# EAGLE board Cannula_mother (EAGLE 8.6.0)
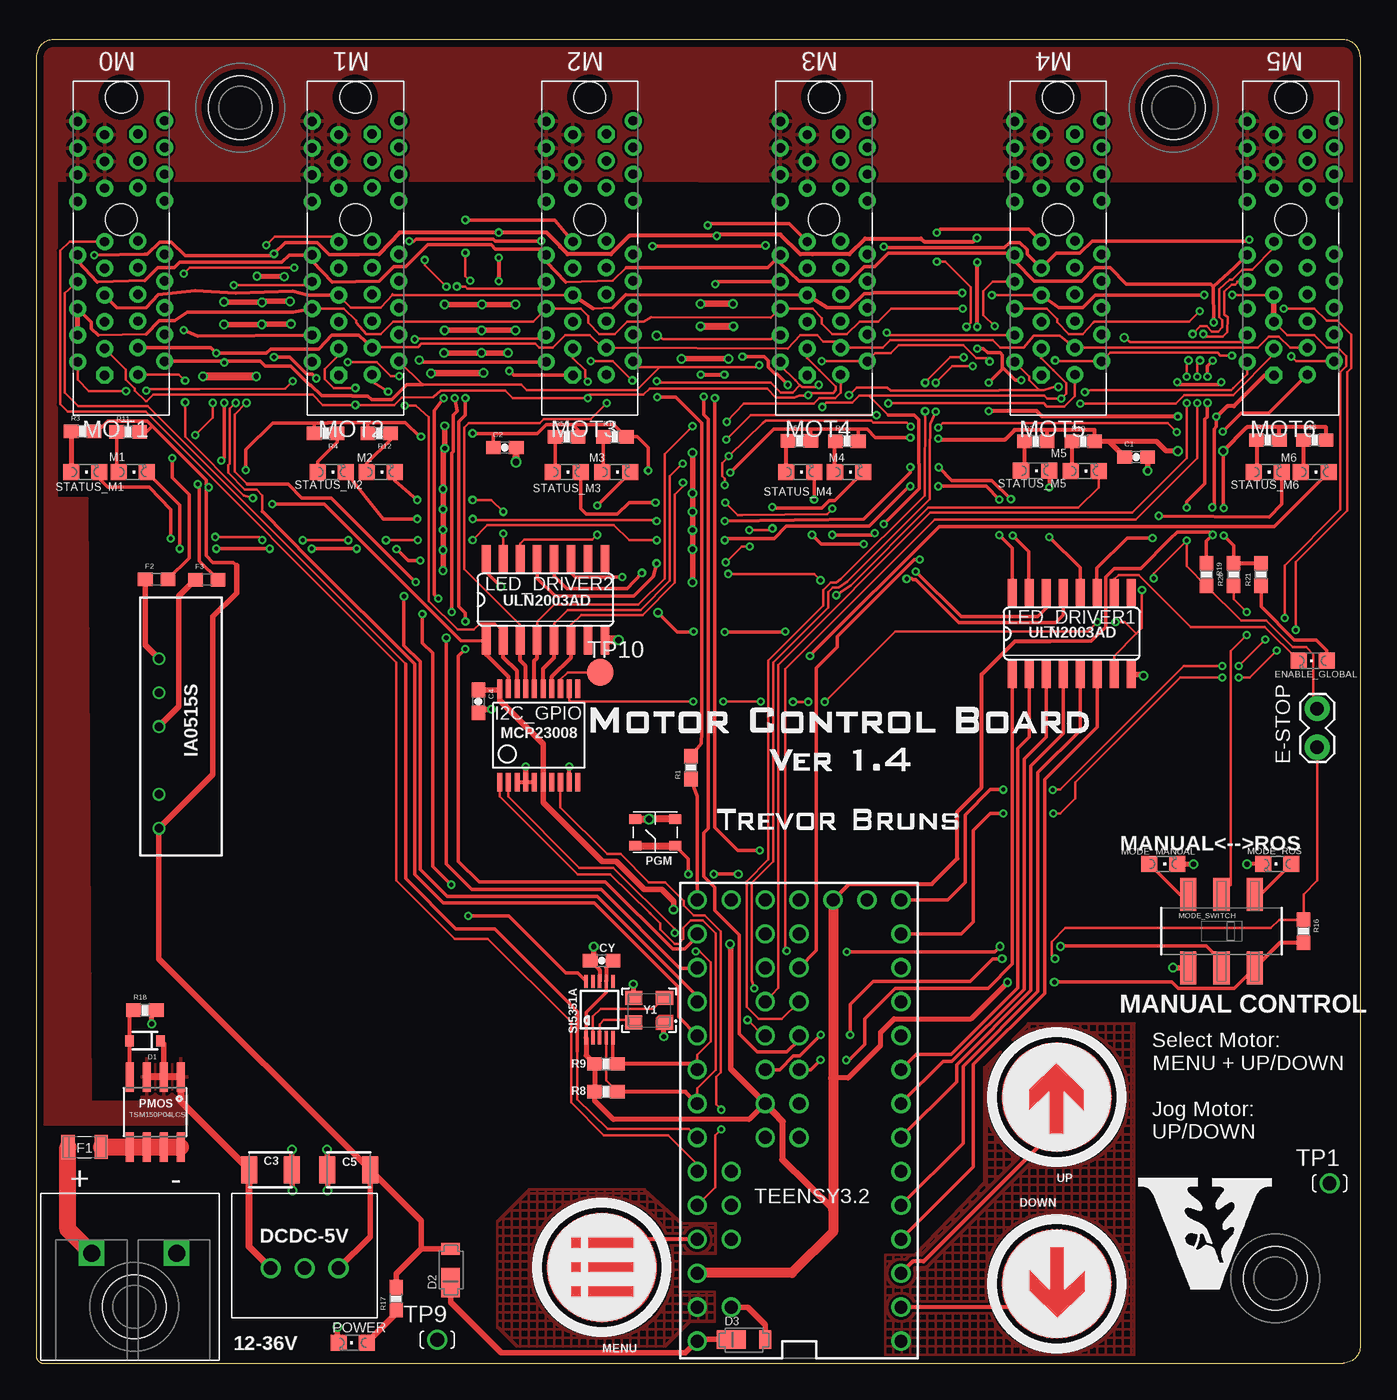
[diagram p1: board, top side]
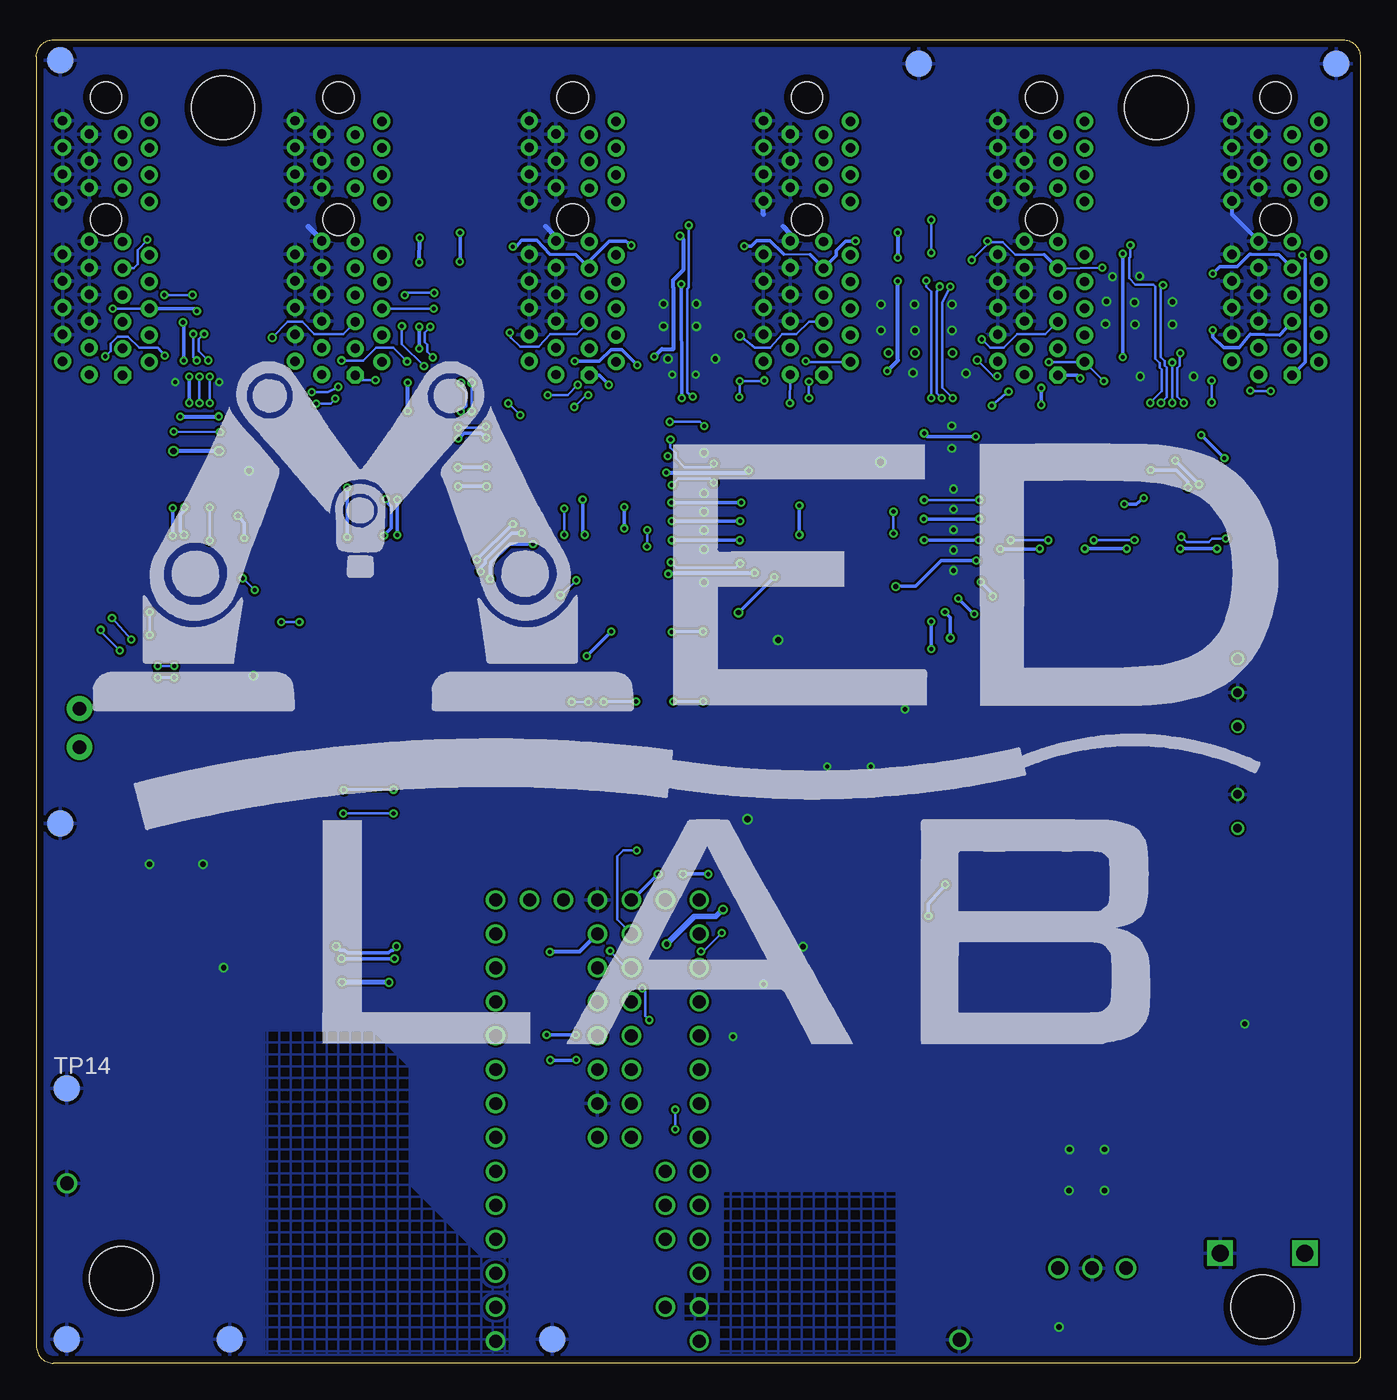
[diagram p2: board, bottom side, seen from below]

Size 99.06 x 99.06 mm. Coordinates in mm from the lower left corner, seen from the top.
Outline: 99.06,97.79 99.06,1.27 arc-90 97.79,0 0.51,0 arc-90 0,0.51 0,97.79 arc-90 1.27,99.06 97.79,99.06 arc-90 99.06,97.79
Copper layers (1*16): Top 0.035mm / dielectric 1.5mm / Bottom 0.035mm
Design rules "PCBWay_2018-01-18": minimum track width 6mil, minimum drill 12mil, track to track 6.5mil, track to pad 6.5mil, pad to pad 6.5mil, via to via 6.5mil, smd to smd 6mil, copper to edge 20mil, drill to drill 8mil, minimum pad ring 6mil, minimum via ring 6mil, stop-mask expansion 4mil, vias tented up to drill 0mil, thermal gap 10mil
Net classes: 1 differential: width 0.152 mm, clearance 0.203 mm

## Footprints (pad centres in the part's own frame; a part is rotated, then mirrored left to right if it is on the bottom)
SPACER = hole 4.75: 0,0
0603-CAP = smd 1.1 x 1: 1 -0.85,0; 2 0.85,0
1210 = smd 1.2 x 2: 1 -1.6,0; 2 1.6,0
MSOP10 = smd 0.25 x 1: 1 -1,-2.113; 2 -0.5,-2.113; 3 0,-2.113; 4 0.5,-2.113; 5 1,-2.113; 6 1,2.113; 7 0.5,2.113; 8 0,2.113; 9 -0.5,2.113; 10 -1,2.113
SOD-323 = smd 0.63 x 0.83: A 1.15,0; C -1.15,0
POWERDI123 = smd 2.2 x 1.4: P$1 -1.6,0 | smd 0.9 x 1.4: P$2 0.95,0
OKI-78SR = drill 1: P$1 -2.54,0; P$2 0,0; P$3 2.54,0
BUTTON_PASSIVE_8MM_UP = smd 0.508 x 0.508: BUTTON 0,3.175
1X02_LOCK = drill 1.016 pad 1.88: 1 -0.178,0; 2 2.718,0
LED-0805 = smd 1.2 x 1.2: A 0,-1.05; C 0,1.05
1206 = smd 1 x 1.8: P$1 -1.25,0; P$2 1.25,0
0603 = smd 1.1 x 1: 1 -0.85,0; 2 0.85,0
SSOP20 = smd 0.38 x 1.4: 1 -2.925,-3.5; 2 -2.275,-3.5; 3 -1.625,-3.5; 4 -0.975,-3.5; 5 -0.325,-3.5; 6 0.325,-3.5; 7 0.975,-3.5; 8 1.625,-3.5; 9 2.275,-3.5; 10 2.925,-3.5; 11 2.925,3.5; 12 2.275,3.5; 13 1.625,3.5; 14 0.975,3.5; 15 0.325,3.5; 16 -0.325,3.5; 17 -0.975,3.5; 18 -1.625,3.5; 19 -2.275,3.5; 20 -2.925,3.5
DCDC_IA_SERIES = drill 0.635: 0V 3.302,-1.397; +VIN -6.858,-1.397; +VOUT 5.842,-1.397; -VIN -4.318,-1.397; -VOUT 0.762,-1.397
SO16 = smd 0.66 x 2.032: 1 -4.445,-3.073; 2 -3.175,-3.073; 3 -1.905,-3.073; 4 -0.635,-3.073; 5 0.635,-3.073; 6 1.905,-3.073; 7 3.175,-3.073; 8 4.445,-3.073; 9 4.445,3.073; 10 3.175,3.073; 11 1.905,3.073; 12 0.635,3.073; 13 -0.635,3.073; 14 -1.905,3.073; 15 -3.175,3.073; 16 -4.445,3.073
BUTTON_PASSIVE_8MM_MENU = smd 0.508 x 0.508: BUTTON 0,3.175
JS202011SCQN = smd 1.2 x 2.5: 1 -2.5,-2.75; 2 0,-2.75; 3 2.5,-2.75; 4 -2.5,2.75; 5 0,2.75; 6 2.5,2.75
PCIE-36-SKT = drill 0.7 pad 1.27 octagon: A1 -11.65,1.25; B17 6.4,-1.25 | drill 0.7 pad 1.27: A2 -10.65,3.25; A3 -9.65,1.25; A4 -8.65,3.25; A5 -7.65,1.25; A6 -6.65,3.25; A7 -5.65,1.25; A8 -4.65,3.25; A9 -3.65,1.25; A10 -2.65,3.25; A11 -1.65,1.25; A12 1.35,3.25; A13 2.35,1.25; A14 3.35,3.25; A15 4.35,1.25; A16 5.35,3.25; A17 6.35,1.25; A18 7.35,3.25; B1 -11.6,-1.25; B2 -10.6,-3.25; B3 -9.6,-1.25; B4 -8.6,-3.25; B5 -7.6,-1.25; B6 -6.6,-3.25; B7 -5.6,-1.25; B8 -4.6,-3.25; B9 -3.6,-1.25; B10 -2.6,-3.25; B11 -1.6,-1.25; B12 1.4,-3.25; B13 2.4,-1.25; B14 3.4,-3.25; B15 4.4,-1.25; B16 5.4,-3.25; B18 7.4,-3.25 | hole 2.35: 0,0; 9.15,0
LS38 = smd 0.9 x 0.7: P$1 -1.5,-1; P$2 1.5,-1; P$3 -1.5,1; P$4 1.5,1
1X02_6.35_SCREWTERM = drill 1.27 square: P1 6.35,0; P2 0,0
0603-RES = smd 1.1 x 1: 1 -0.85,0; 2 0.85,0
TEENSY_3.0_ALLPINS = drill 0.965: 0 -7.62,13.97; 1 -7.62,11.43; 2 -7.62,8.89; 3 -7.62,6.35; 3.3V 7.62,11.43; 3.3V1 -2.54,-16.51; 3.3V2 2.54,-1.27; 4 -7.62,3.81; 5 -7.62,1.27; 6 -7.62,-1.27; 7 -7.62,-3.81; 8 -7.62,-6.35; 9 -7.62,-8.89; 10 -7.62,-11.43; 11 -7.62,-13.97; 12 -7.62,-16.51; 13 7.62,-16.51; 14/A0 7.62,-13.97; 15/A1 7.62,-11.43; 16/A2 7.62,-8.89; 17/A3 7.62,-6.35; 18/A4 7.62,-3.81; 19/A5 7.62,-1.27; 20/A6 7.62,1.27; 21/A7 7.62,3.81; 22/A8 7.62,6.35; 23/A9 7.62,8.89; 24 0,-3.81; 25 0,-6.35; 26 0,-8.89; 27 0,-11.43; 28 0,-13.97; 29 2.54,-13.97; 30 2.54,-11.43; 31 2.54,-8.89; 32 2.54,-6.35; 33 2.54,-3.81; A10 5.08,6.35; A11 5.08,3.81; A12 0,1.27; A13 2.54,1.27; AGND 7.62,13.97; AREF 5.08,8.89; GND -7.62,16.51; GND1 0,-16.51; GND2 0,-1.27; PGM 2.54,-16.51; RESET 5.08,-16.51; VBAT -5.08,-16.51; VIN 7.62,16.51; VUSB 5.08,13.97
TEST-POINT_5021 = drill 1.016: P$1 0,0
TP20R = smd 2 x 2: TP 0,0
SO08 = smd 0.61 x 2.21: 1 -1.905,-2.616; 2 -0.635,-2.616; 3 0.635,-2.616; 4 1.905,-2.616; 5 1.905,2.616; 6 0.635,2.616; 7 -0.635,2.616; 8 -1.905,2.616
CX3225SB = smd 1.3 x 1.05: GND@1 -1.15,0.925; HOT1 -1.15,-0.925; HOT2 1.15,0.925 | smd 1.1 x 0.85: GND@2 1.2,-0.975

## Placement (x,y rotation side)
24V  [SPACER]  7.32,4.22 180 top
C1  100nF  [0603-CAP]  82.3,67.82 0 top
C2  100nF  [0603-CAP]  35.05,68.53 0 top
C3  10uF  [1210]  17.53,14.48 0 top
C4  100nF  [0603-CAP]  33.07,49.53 270 top
C5  10uF  [1210]  23.37,14.48 180 top
CLOCKGEN  SI5351A  [MSOP10]  42.14,26.47 0 top
CY  100nF  [0603-CAP]  42.29,30.12 180 top
D1  10V  [SOD-323]  8.13,24.13 180 top
D2  DIODE-POWERDI123  [POWERDI123]  30.99,7.62 90 top
D3  DIODE-POWERDI123  [POWERDI123]  53.59,1.78 0 top
DCDC-5V  OKI-78SR  [OKI-78SR]  20.07,7.11 0 top
DOWN  [BUTTON_PASSIVE_8MM_UP]  76.35,5.94 180 top
E-STOP  M02LOCK  [1X02_LOCK]  95.83,46.28 90 top
ENABLE_GLOBAL  LED_R  [LED-0805]  95.5,52.58 90 top
F1  12A  [1206]  3.61,16.18 0 top
F2  PTC0603  [0603]  8.99,58.67 0 top
F3  PTC0603  [0603]  12.75,58.65 0 top
I2C_GPIO  MCP23008  [SSOP20]  37.59,46.99 0 top
IA0515S  DCDC_IA_SERIES0515S  [DCDC_IA_SERIES]  7.77,46.89 90 top
LED_DRIVER1  ULN2003AD  [SO16]  77.47,54.61 0 top
LED_DRIVER2  ULN2003AD  [SO16]  38.1,57.15 0 top
M1  LED_R  [LED-0805]  7.21,66.7 270 top
M2  LED_R  [LED-0805]  25.76,66.7 270 top
M3  LED_R  [LED-0805]  43.38,66.7 270 top
M4  LED_R  [LED-0805]  60.81,66.7 270 top
M5  LED_R  [LED-0805]  78.44,66.78 270 top
M6  LED_R  [LED-0805]  95.66,66.7 270 top
MENU  [BUTTON_PASSIVE_8MM_MENU]  42.32,7.16 0 top
MODE_MANUAL  LED_G  [LED-0805]  84.33,37.36 270 top
MODE_ROS  LED_G  [LED-0805]  92.86,37.36 90 top
MODE_SWITCH  SWITCH-DPDT-SLIDER-SMD  [JS202011SCQN]  88.68,32.33 0 top
MOT1  [PCIE-36-SKT]  6.35,85.6 90 top
MOT2  [PCIE-36-SKT]  23.88,85.6 90 top
MOT3  [PCIE-36-SKT]  41.4,85.6 90 top
MOT4  [PCIE-36-SKT]  58.93,85.6 90 top
MOT5  [PCIE-36-SKT]  76.45,85.6 90 top
MOT6  [PCIE-36-SKT]  93.85,85.6 90 top
PGM  SWITCH-TACT  [LS38]  46.3,39.73 0 top
POWER  LED_G  [LED-0805]  23.67,1.52 90 top
PWN_MAIN  M026.35MM_SCREWTERM  [1X02_6.35_SCREWTERM]  4.14,8.23 0 top
R1  33  [0603-RES]  48.97,44.58 90 top
R2  140  [0603-RES]  74.78,68.99 0 top
R3  140  [0603-RES]  3.45,69.75 0 top
R4  140  [0603-RES]  21.64,69.6 180 top
R5  140  [0603-RES]  39.67,69.34 0 top
R6  140  [0603-RES]  57.1,69.04 0 top
R7  140  [0603-RES]  92.15,69.09 0 top
R8  2.7k  [0603-RES]  42.62,20.32 180 top
R9  2.7k  [0603-RES]  42.62,22.4 180 top
R10  150  [0603-RES]  78.33,68.99 0 top
R11  150  [0603-RES]  6.86,69.7 0 top
R12  150  [0603-RES]  25.65,69.6 180 top
R13  150  [0603-RES]  43.28,69.34 0 top
R14  150  [0603-RES]  60.66,69.01 0 top
R15  150  [0603-RES]  95.66,69.09 0 top
R16  10k  [0603-RES]  94.82,32.33 270 top
R17  140  [0603-RES]  26.92,4.83 90 top
R18  10k  [0603-RES]  8.13,26.42 0 top
R19  10k  [0603-RES]  87.55,59.03 270 top
R20  140  [0603-RES]  89.59,59.03 90 top
R21  150  [0603-RES]  91.64,59.03 90 top
STATUS_M1  LED_G  [LED-0805]  3.66,66.7 270 top
STATUS_M2  LED_G  [LED-0805]  22.1,66.7 270 top
STATUS_M3  LED_G  [LED-0805]  39.67,66.7 270 top
STATUS_M4  LED_G  [LED-0805]  57.15,66.7 270 top
STATUS_M5  LED_G  [LED-0805]  74.73,66.8 270 top
STATUS_M6  LED_G  [LED-0805]  92.15,66.7 270 top
TEENSY3.2  TEENSY_3.0_ALLPINS  [TEENSY_3.0_ALLPINS]  57.07,18.16 180 top
TP1  TEST-POINT_5021  [TEST-POINT_5021]  96.77,13.46 0 top
TP2  PTR1TP20R  [TP20R]  1.78,97.28 0 bottom
TP3  PTR1TP20R  [TP20R]  96.77,1.78 0 bottom
TP4  PTR1TP20R  [TP20R]  97.28,97.54 0 bottom
TP5  PTR1TP20R  [TP20R]  33.02,97.28 0 bottom
TP6  PTR1TP20R  [TP20R]  84.58,1.78 0 bottom
TP7  PTR1TP20R  [TP20R]  60.45,1.78 0 bottom
TP8  PTR1TP20R  [TP20R]  97.28,40.39 0 bottom
TP9  TEST-POINT_5021  [TEST-POINT_5021]  30,1.75 0 top
TP10  PTR1TP20R  [TP20R]  42.19,51.71 0 top
TP14  PTR1TP20R  [TP20R]  96.77,20.57 0 bottom
TSM150P04LCS  PMOS  [SO08]  8.89,18.8 180 top
U$1  [SPACER]  92.71,6.35 180 top
U$2  [LOGO_MOTOR_CONTROL_1.4]  60.22,44.45 0 top
U$3  [SPACER]  85.09,93.98 180 top
U$4  [SPACER]  15.27,93.98 180 top
U$6  [LOGO_MEDLAB_3X2]  50.77,49.48 0 bottom
U$8  [LOGO_V_OAK]  87.88,10.41 0 top
UP  [BUTTON_PASSIVE_8MM_UP]  76.35,19.91 0 top
Y1  25 MHZ  [CX3225SB]  45.85,26.42 0 top

## Tracks (layer width: path | path; a pad name or v marks a point on that pad's centre or on a via)
3.3V  (via drill 0.3, 0.3 pad 0.41, 0.36, 0.41)
  Top 0.254: 25.65,83.01 24.13,82.98 23.62,82.98 22.15,82.96 21.93,82.96 21.01,83.88 18.62,83.88 v17.78,83.03 17.63,82.88 11.12,82.88 10.08,83.92 9.22,83.92 8.3,83.01 8.1,83.01 v4.34,82.93 | CLOCKGEN.7 42.64,27.75 41.15,26.26 41.15,24.36 CLOCKGEN.1 | v70.41,75.95 70.86,75.95 71.18,75.63 72.11,75.63 72.28,75.46 72.28,74.56 | v73.69,73.58 73.26,73.58 72.28,74.56 | v71.27,73.41 72.28,74.41 72.28,74.56 | v52.83,75.34 54.46,75.34 54.75,75.04 54.75,74.56 55.29,74.02 55.44,74.02 v56.24,73.23 | v35.38,74.27 35.7,73.95 MOT3.A1 | v20.95,73.71 20.64,74.02 20.24,74.02 18.95,75.31 v17.78,75.31 | v76.17,28.52 84.97,28.52 85.46,28.04 89.64,28.04 MODE_SWITCH.3 | v88.29,70.84 88.29,70.09 88.12,69.92 88.12,64.2 v87.99,64.06 | R19.1 87.55,61.54 v88.01,62 87.8,62.22 85.36,62.22 84.81,61.67 82.62,59.49 80.67,59.49 80.01,58.83 80.01,55.12 78.94,54.05 75.84,54.05
  Top 0.305: 25.65,83.01 27.18,84.63 v34.59,84.63 38.18,84.63 39.2,83.61 39.2,83.55 39.76,83 43,83 44.38,84.38 v50.9,84.38 51,84.48 55.68,84.48 57.16,83 58.07,83 58.08,83.01 60.84,83.01 62.02,84.19 66.18,84.19 66.42,83.95 70.1,83.95 v70.38,84.23 | MOT6.A1 91.93,73.95 89.61,71.63 89.11,71.63 88.33,70.84 v88.29,70.84 | CY.1 42.64,29.62 CLOCKGEN.7 | v85.42,70.87 75.25,70.87 74.84,71.27 v71.27,71.27 | v70.41,77.57 v70.41,82.4 | v34.59,82.75 v34.59,81 | TEENSY3.2.3.3V1 60.81,35.87 67,35.87 68.91,37.77 68.91,41.27 70.74,43.1 70.74,51.56 73.23,54.05 75.84,54.05 | MODE_SWITCH.3 93.08,31.48 R16.2
  Top 0.356: 59.61,21.34 60.73,21.34 63.14,23.75 63.14,24.74 64.19,25.78 69.95,25.78 v72.67,28.5
  Top 0.381: CLOCKGEN.1 41.14,23.04 R9.2 R8.2 41.77,19.65 43.18,18.24 53.34,18.24 TEENSY3.2.3.3V2
  Top 0.406: v51.89,31.37 51.94,31.32 51.94,22.02 TEENSY3.2.3.3V2 | v47.68,33.96 47.68,34.57 46.79,35.46 45.49,35.46 43.38,37.57 42.33,37.57 37.92,41.98 I2C_GPIO.6 37.92,46.34 34.67,49.59 I2C_GPIO.20 34.56,50.38 C4.1
  Top 0.457: 55.83,18.09 55.83,15.24
  Top 0.508: TEENSY3.2.3.3V2 55.83,18.09 | 55.83,15.24 59.61,11.51
  Top 0.762: TEENSY3.2.3.3V1 59.61,21.34 59.61,11.51 59.61,9.83 56.54,6.76 49.48,6.76 TEENSY3.2.3.3V
  Bottom 0.203: MOT5.A1 74.84,73.58 v73.69,73.58
  Bottom 0.254: MOT1.A1 4.12,74.93 4.12,82.65 v4.34,82.93 | MOT4.A1 56.95,73.95 v56.24,73.23 | v70.41,75.95 v70.41,77.57 | MOT2.A1 21.19,73.95 v20.95,73.71 | v17.78,75.31 v17.78,83.03 | v87.99,64.06 87.99,63.83 88.29,63.52 88.29,62.28 v88.01,62
  Bottom 0.305: v88.29,70.84 85.45,70.84 v85.42,70.87 | v71.27,71.27 v71.27,73.41 | v70.41,82.4 v70.38,84.23 | v52.83,75.34 52.25,75.92 51.38,75.92 51.38,80.48 51.42,80.51 51.42,81.06 50.66,81.83 50.66,84.14 v50.9,84.38 | v34.59,84.63 v34.59,82.75 | v35.38,74.27 34.59,75.06 v34.59,81
  Bottom 0.356: v72.67,28.5 76.15,28.5 v76.17,28.52
  Bottom 0.406: v51.89,31.37 49.84,33.43 48.21,33.43 v47.68,33.96
5V  (via drill 0.3, 0.46)
  Top 0.203: 57.94,69.9 57.95,69.89
  Top 0.254: 40.13,70.26 43.22,70.26 R13.2 44.96,69.34 45.77,68.53 v45.77,66.8 | 40.13,70.26 38.15,70.26 37.49,69.6 34.29,69.6 | v51.92,66.65 55.17,69.9 57.94,69.9 | R5.2 40.52,69.86 40.13,70.26 | 24.89,70.4 27.62,70.4 28.68,69.34 v28.78,69.34 | 24.89,70.4 21.82,70.4 21.8,70.38 20.83,70.38 | 20.83,70.38 17.68,70.38 15.67,68.38 v15.67,66.85 | R4.2 20.79,70.35 20.83,70.38 | R12.2 24.8,70.31 24.89,70.4 | R3.2 4.58,69.75 5.33,70.5 8.31,70.5 8.67,70.14 | 8.67,70.14 11.21,67.6 | 11.21,67.6 11.47,67.34 | R11.2 8.23,69.7 8.67,70.14 | 11.21,67.6 12.7,66.11 12.7,65.75 v12.89,65.56 12.7,65.37 12.7,60.45 13.21,59.94 14.73,59.94 14.99,59.69 | R6.2 57.94,69.05 57.94,69.9 | 57.94,69.9 61.47,69.9 | R14.2 61.51,69.86 61.47,69.9 | v65.41,69.29 62.79,69.29 62.18,69.9 61.47,69.9 | 34.29,69.6 v32.64,69.6 | C2.1 34.2,69.51 34.29,69.6 | v88.8,68.28 88.8,64.06 v88.85,64.01 | R20.2 89.59,61.21 v88.85,61.95
  Top 0.305: v45.77,66.8 45.77,66.6 | 75.69,69.85 79.18,69.85 R10.2 79.5,68.99 79.6,69.09 | 75.69,69.85 73.2,69.85 72.49,69.14 67.56,69.14 v67.49,69.22 | R15.2 96.51,70.05 92.96,70.05 | 92.96,70.05 90.58,70.05 v88.8,68.28 | R7.2 93,70.02 92.96,70.05 | R20.2 R21.2 | R2.2 75.63,69.79 75.69,69.85
  Top 0.356: C1.1 80.28,68.99 | 80.28,68.99 79.5,68.99 | v85.39,68.28 84.53,68.28 83.82,68.99 80.28,68.99
  Top 0.406: 28.8,8.57 D2.P$2 | 28.8,8.57 26.92,6.69 R17.2 | C5.1 24.97,9.47 DCDC-5V.P$3 | C5.1 28.8,10.64 28.8,8.57 | C5.1 9.17,30.28 IA0515S.+VIN 13.21,44.07 13.21,55.88 14.99,57.66 14.99,59.69
  Bottom 0.254: v65.41,69.29 65.62,69.51 65.68,69.51 65.81,69.63 67.04,69.63 67.24,69.43 67.27,69.43 v67.49,69.22 | v15.67,66.85 13.77,66.85 12.89,65.98 v12.89,65.56 | v32.64,69.6 32.38,69.34 v28.78,69.34 | v88.85,64.01 v88.85,61.95
  Bottom 0.305: v51.92,66.65 45.77,66.65 v45.77,66.8 | v85.39,68.28 v88.8,68.28
+15V  (via drill 0.3)
  Top 0.203: 25.18,76.02 MOT2.B3 25.19,76.06 28.56,76.06 28.8,76.3 37.34,76.3 37.62,76.02 38.63,76.02 39.57,76.96 41.4,76.96 42.37,76 MOT3.B3 56.24,75.95 57.15,76.96 58.42,76.96 58.88,76.45 59.72,76.45 MOT4.B3 63.32,76 63.91,76.58 71.55,76.58 72.11,76.02 73.89,76.02 74.62,76.91 76.59,76.91 MOT5.B3 91.38,76 92.23,76.85 92.98,76.85 93.83,76 MOT6.B3 | v11.89,69.47 13.21,70.79 v13.21,71.88
  Top 0.254: MOT2.B3 24.11,76.96 22.1,76.96 21.18,75.95 21.14,75.91 17.53,75.91 17.22,75.59 v13.46,75.59 13.06,76 MOT1.B3 | F2.2 11.43,60.26 11.43,65.02 10.16,66.29 v10.16,67.74
  Bottom 0.203: v13.21,71.88 13.69,72.36 13.69,74.47 13.49,74.67 13.49,75.57 v13.46,75.59
  Bottom 0.254: v10.16,67.74 v11.89,69.47
-15V  (via drill 0.3, 0.3 pad 0.36, 0.3 pad 0.41)
  Top 0.203: MOT2.B2 28.92,73.25 36.27,73.25 36.68,72.85 44.93,72.85 46.65,74.56 | v89.46,75.43 88.59,75.43 88.39,75.63 80.34,75.63 MOT5.B2 76.28,75 v76.22,75.06 | v93.9,75.36 94.27,75 MOT6.B2 | v71.32,74.98 71.07,75.23 70.31,75.23 69.35,76.2 64.54,76.2 63.93,75.59 62.77,75.59 MOT4.B2 58.78,75 v58.78,75.01 | 46.65,74.56 53.96,74.56 v54.1,74.7 | MOT3.B2 45.09,74.56 46.65,74.56
  Top 0.254: MOT1.B2 13.97,75 v14.06,74.91 14.15,75 16.75,75 17.12,74.62 19.05,74.62 20.47,73.2 20.55,73.2 21.34,72.42 23.62,72.42 23.63,72.4 24.8,72.4 25.08,72.12 26.58,72.12 27.71,73.25 28.92,73.25 | F3.2 12.19,60.06 12.19,65.66 v12.06,65.79 | v13.84,67.56 14.07,67.79 v14.07,71.88
  Bottom 0.203: 14.06,71.69 v14.06,74.91 | v89.46,75.43 89.98,76 91.38,76 92.23,76.85 92.98,76.85 93.5,76.32 93.5,75.76 v93.9,75.36 | v71.32,74.98 72.36,76.02 73.64,76.02 74.61,75.05 75.58,75.05 75.59,75.06 v76.22,75.06
  Bottom 0.254: 14.06,71.69 v14.07,71.88 | v12.06,65.79 v13.84,67.56 | v58.78,75.01 56.93,75.01 56.06,75.88 55.28,75.88 v54.1,74.7
BRAKE_HW  (via drill 0.3)
  Top 0.203: I2C_GPIO.12 39.87,49.62 39.96,49.52 v49.14,49.52 v49.15,49.53 | 44.15,81.99 43.13,81.03 39.62,80.92 | LED_DRIVER1.7 80.64,52.93 82.31,54.6 | v82.73,57.86 82.73,55.02 82.31,54.6 | v83.62,58.75 83.62,59.11 v86.08,61.57 86.08,59.65 R19.2 90.16,55.58 92.02,55.58 94,53.59 95.02,53.59 95.56,53.05 95.56,49.28 E-STOP.2 | v51.41,49.53 v54.19,49.53 | v56.62,49.51 v57.76,49.51 | v59,49.51 64.26,54.76 78.66,54.76 v79.38,55.47 | v80.75,55.47 81.43,55.47 82.31,54.6
  Top 0.229: 8.13,81.03 4.57,80.92
  Top 0.254: 44.15,81.99 54.72,81.99 MOT4.A10 55.68,82.35 57.1,80.97 60.84,80.97 61.94,82.07 62.75,82.07 63.76,83.08 70.4,83.08 70.42,83.07 73.08,83.07 MOT5.A10 73.2,82.5 74.68,80.97 78.23,80.97 79.2,81.99 80.34,81.99 81.56,80.77 87.87,80.77 88.06,80.58 | 39.62,80.92 38.15,82.45 MOT3.A10 37.7,83.4 34.34,83.4 34.02,83.72 29.29,83.72 27.64,82.07 26.75,82.07 25.65,80.97 22.15,80.92 20.63,82.5 MOT2.A10 18.91,82.95 18.36,82.4 17.42,82.4 10.72,82.4 10.31,81.99 9.09,81.99 8.13,81.03 | 4.57,80.92 3.1,82.5 MOT1.A10 | MOT6.A10 89.65,81.99 88.06,80.58 | v87.63,71.88 87.62,71.87 87.62,70.83 87.44,70.65 87.44,65.85 86.08,64.49 v86.08,64.03 | v87.63,73.84 87.63,74.62 v88.04,75.03 | v88.09,77.9 88.06,80.58
  Bottom 0.203: v86.08,64.03 v86.08,61.57 | v82.73,57.86 v83.62,58.75 | v49.15,49.53 v51.41,49.53 | v54.19,49.53 56.59,49.53 v56.62,49.51 | v57.76,49.51 v59,49.51 | v79.38,55.47 v80.75,55.47
  Bottom 0.254: v87.63,71.88 v87.63,73.84 | v88.09,77.9 88.04,77.7 v88.04,75.03
BRAKE_SW1
  Top 0.178: MOT1.A11 2.52,83.95 1.78,83.26 1.78,71.78 2.34,71.22
  Top 0.203: TEENSY3.2.21/A7 49.45,14.88 47.27,17.07 42.47,17.07 40.01,19.53 40.01,25.53 33.78,31.75 31.29,31.75 26.92,36.12 26.92,52.43 8.18,71.22 2.34,71.22
BRAKE_SW2  (via drill 0.3, 0.3 pad 0.41)
  Top 0.203: v17.2,83.69 17.83,84.33 22.25,84.33 MOT2.A11 | 15.77,65.79 14.83,66.72 14.83,70.99 v15.72,71.88
  Top 0.254: TEENSY3.2.16/A2 49.45,27.46 41.96,34.95 30.73,34.95 28.73,36.96 28.73,52.5 27.51,53.72 v27.51,57.4 | v28.4,58.47 28.35,58.47 22.05,64.77 19.86,64.77 18.85,65.79 15.77,65.79
  Bottom 0.203: v15.72,71.88 14.86,72.75 14.86,74.37 15,74.52 15,74.85 15.34,75.19 15.34,80.57 15.51,80.74 16.83,80.74 17.3,81.2 17.3,82.71 17.21,82.8 v17.21,83.68 v17.2,83.69
  Bottom 0.254: v28.4,58.47 27.51,57.58 v27.51,57.4
BRAKE_SW3  (via drill 0.3, 0.3 pad 0.3)
  Top 0.203: v32.11,83.11 32.11,81.38 v32.46,81.03
  Top 0.254: MOT3.A11 38.81,85.57 v32.11,85.57 | TEENSY3.2.14/A0 49.45,31.93 48.51,30.99 47.6,30.99 42.57,36.02 33.12,36.02 31.57,37.57 31.57,52.93 v32.1,53.46 | v32.11,72.24 32.11,70.97 31.62,70.48 31.62,56.62 32.11,56.13 v32.11,55.51
  Bottom 0.203: v32.11,85.57 v32.11,83.11 | v32.46,81.03 32.46,80.57 32.11,80.21 v32.11,72.24
  Bottom 0.254: v32.1,53.46 v32.1,55.5 v32.11,55.51
BRAKE_SW4  (via drill 0.3)
  Top 0.254: MOT4.A11 56.33,85.29 50.37,85.29 v50.24,85.17 | v49.94,72.34 49.94,70.99 50.27,70.66 50.27,40.01 49.94,39.67 49.94,36.42 50.75,35.61 50.75,33.88 52.58,32.05 52.58,24.64 53.92,23.29 56.16,23.29 57.07,24.21 TEENSY3.2.25
  Bottom 0.203: v49.94,72.34 50.37,72.64 50.37,80.4 50.23,80.53 50.23,81.01 50.24,81.02 v50.24,85.17
BRAKE_SW5  (via drill 0.3)
  Top 0.203: v66.5,71.25 66.47,65.89 66.47,64.95 60.2,58.67 59.86,58.45 59.44,58.45 58.88,57.88 58.88,56.7 54.76,52.59 54.76,37.7 53.14,36.07 53.14,26.67 54.05,25.76 55.78,25.76 TEENSY3.2.26 | v66.5,73.38 66.71,73.6 66.71,73.62 68.38,75.29 v69.39,75.29 | v67.39,82.45 68.02,82.45 69.93,80.54 69.93,77.9 v69.6,77.57
  Top 0.254: MOT5.A11 74.27,84.89 67.64,84.89 v67.36,84.61
  Bottom 0.203: v66.5,71.25 v66.5,73.38 | v69.39,75.29 69.83,75.72 69.83,76.25 70.02,76.44 70.02,77.15 v69.6,77.57
  Bottom 0.254: v67.36,84.61 67.36,82.47 v67.39,82.45
BRAKE_SW6  (via drill 0.3)
  Top 0.203: TEENSY3.2.31 55.52,28.09 55.52,52.25 66.9,63.65 81.99,63.65 86.08,67.74 v86.08,71.86 | v86.08,73.84 86.08,74.93 v86.21,75.06 | MOT6.A11 92.6,83.48 90.97,81.85 90.23,81.85 89.48,81.1 89.31,81.1 88.51,80.4 88.51,78.29 88.73,78.06 88.73,77.53 88.42,77.22 87.96,77.22 87.56,77.61 87.08,77.61 v86.51,77.04
  Bottom 0.203: v86.08,71.86 v86.08,73.84 | v86.21,75.06 86.92,75.77 86.92,76.63 v86.51,77.04
CLK0  (via drill 0.3, 0.3 pad 0.3)
  Top 0.203: v30.68,80.57 29.06,82.2 v29.06,82.58 | v11.02,81.56 11.47,82 17.26,82 17.42,82 19.29,82 v19.3,81.99
  Top 0.254: v46.1,83.62 54.61,83.62 v54.56,83.67 | CLOCKGEN.10 40.51,29.21 39.62,29.21 35.36,33.48 v32.31,33.48 | v30.48,72.24 29.78,71.28 29.78,70.67 29.77,70.66 29.77,57.53 v30.07,57.23 | v90.75,84.1 90.65,84 79.02,84 78.09,83.07 76.33,83.07 MOT5.A9 74.13,83.02 74.13,83.33 73.59,83.88 72.82,83.88 72.43,83.49 70.59,83.49 70.57,83.5 63.46,83.5 v63.4,83.57 | v27.89,83.97 28.25,83.97 28.42,84.15 34.18,84.15 34.33,84 v37.77,84 | v28.89,56.07 28.89,53.92 29.67,53.14 29.67,37.19 v31.04,35.81
  Bottom 0.178: MOT6.A9 91.79,81.95 91.49,82.24 91.49,83.32 90.75,84.05 v90.75,84.1
  Bottom 0.203: MOT1.A9 4.88,81.95 | 22.62,81.94 v19.3,81.99 | 41.16,82.96 43.13,83.01 | v30.48,72.24 31.27,73.03 31.27,79.38 v30.68,80.57 | v29.06,82.58 27.89,83.74 v27.89,83.97 27.82,83.9 26.75,83.9 25.81,82.96 23.63,82.96
  Bottom 0.254: 22.62,81.94 MOT2.A9 23.63,82.96 | 6.35,82.96 8.18,83.01 8.28,83.01 9.22,82.07 10.51,82.07 v11.02,81.56 | 6.35,82.96 6.11,82.96 | v63.4,83.57 63.14,83.57 62.74,84.07 61.62,84.07 60.66,83.01 58.69,82.96 MOT4.A9 57.68,82.48 56.19,83.97 54.97,83.97 v54.56,83.67 | 41.16,82.96 MOT3.A9 39.22,82.88 39.22,83.26 38.48,84 v37.77,84 | 43.13,83.01 44.2,84.02 45.16,84.02 45.57,83.62 v46.1,83.62 | v32.31,33.48 32.31,34.39 v31.04,35.81 | MOT1.A9 6.11,82.96 6.35,82.96 | v30.07,57.23 28.91,56.07 v28.89,56.07
ENABLE_GLOBAL  (via drill 0.3, 0.36)
  Top 0.203: v76.22,30.28 75.97,30.53 75.97,31.55 76.99,32.56 92.38,32.56 93,33.18 R16.1 94.82,35.1 95.83,36.12 E-STOP.1
  Top 0.254: v60.88,24.56 60.88,26.85 62.61,28.57 69.88,28.57 71.58,30.28 v72.26,30.28 | v58.7,24.56 57.12,22.99 56.65,22.99 55.64,21.97 TEENSY3.2.33
  Bottom 0.254: v72.26,30.28 v76.22,30.28 | v60.88,24.56 v58.7,24.56
ENABLE_INT  (via drill 0.3)
  Top 0.203: TEENSY3.2.22/A8 50.8,13.16 50.8,17.04 v51.26,17.5 | I2C_GPIO.8 39.22,41.61 42.72,38.1 43.71,38.1 45.82,35.99 47.07,35.99 48.45,34.61 48.45,34.26 49.19,33.52 50.03,33.52 51.22,32.32 51.22,21.78 50.88,21.44 50.88,19.36 v51.26,18.97
  Bottom 0.203: v51.26,18.97 v51.26,17.5
ENABLE_M1  (via drill 0.3, 0.3 pad 0.41)
  Top 0.203: v16.2,64.75 15.55,64.95 15.53,64.95 11.12,69.36 v11.12,71.92 | MOT1.B1 10.66,74 v11.12,73.53
  Top 0.254: v17.65,64.31 21.54,64.31 31.75,54.1 33.63,54.05 LED_DRIVER2.1
  Top 0.305: LED_DRIVER2.1 33.66,53.03 35.33,51.36 35.32,51.34 I2C_GPIO.19
  Bottom 0.203: v11.12,73.53 v11.12,71.92
  Bottom 0.254: v17.65,64.31 16.76,64.31 v16.2,64.75
ENABLE_M2  (via drill 0.3)
  Top 0.203: v27.56,71.68 28.37,71.68 29.36,70.81 29.36,57.06 31.53,54.9 32.73,54.9 33.21,55.37 34.29,55.37 34.9,54.76 34.9,54.1 LED_DRIVER2.2 | v26.31,72.72 25.13,73.48 MOT2.B1
  Top 0.305: I2C_GPIO.18 35.97,51.79 34.92,52.83 LED_DRIVER2.2
  Bottom 0.203: v27.56,71.68 26.52,72.57 v26.31,72.72
ENABLE_M3  (via drill 0.3 pad 0.41)
  Top 0.203: LED_DRIVER2.3 36.17,54.1 36.17,55.27 32.02,59.42 32.02,70.02 32.36,70.36 37.68,70.36 37.98,70.66 41.48,70.66 v42.67,71.86
  Top 0.305: I2C_GPIO.17 36.62,52.18 36.2,52.6 LED_DRIVER2.3
  Bottom 0.203: v42.67,71.86 42.65,73.79 MOT3.B1
ENABLE_M4  (via drill 0.3, 0.3 pad 0.41)
  Top 0.203: v51.66,70.46 52.93,71.83 58.15,71.83 58.57,72.25 59.76,72.25 60.18,72.66 MOT4.B1 | LED_DRIVER2.4 37.49,54.1 37.49,55.52 38.73,56.77 45.05,56.77 47.02,58.73 47.02,68.05 v49.1,70.13
  Top 0.305: I2C_GPIO.16 37.27,52.58 37.47,52.78 LED_DRIVER2.4
  Bottom 0.203: v51.66,70.46 49.43,70.46 v49.1,70.13
ENABLE_M5  (via drill 0.3)
  Top 0.203: v51.61,69.14 53.44,70.97 v62.87,70.97 | 38.71,54.1 LED_DRIVER2.5 | 38.76,54.1 38.76,55.37 39.78,56.39 45.21,56.39 47.4,58.57 47.4,66.4 48.34,67.33 v48.36,67.33 | MOT5.B1 77.7,72.4 76.92,71.61 75.62,71.61 75.39,71.84 v63.75,71.84
  Top 0.305: 38.57,53.91 LED_DRIVER2.5 | I2C_GPIO.15 37.92,51.99 38.73,52.81 LED_DRIVER2.5 | LED_DRIVER2.5 38.76,54.1
  Bottom 0.203: v48.36,67.33 48.62,67.08 50.57,67.08 51.23,67.74 51.23,68.14 51.61,68.52 v51.61,69.14 | v62.87,70.97 v63.74,71.84 v63.75,71.84
ENABLE_M6  (via drill 0.3)
  Top 0.203: LED_DRIVER2.6 40.03,54.1 40.03,55.27 40.77,56.01 45.37,56.01 47.78,58.41 47.78,65.02 48.39,65.63 v48.39,65.91 | v51.51,65.73 51.51,66.19 51.31,66.4 51.31,67.39 v51.82,67.89 54.36,70.36 54.56,70.56 62.46,70.56 62.63,70.4 65.14,70.4 v65.43,70.1 | v85.32,69.7 84.66,70.36 67.82,70.36 v67.49,70.03
  Top 0.254: MOT6.B1 92.22,71.12 90.17,71.12 v88.77,69.72
  Top 0.305: I2C_GPIO.14 38.57,51.39 40.01,52.83 LED_DRIVER2.6
  Bottom 0.203: v88.77,69.72 v85.32,69.7 | v48.39,65.91 48.69,66.22 51.03,66.22 v51.51,65.73 | v67.49,70.03 65.51,70.03 v65.43,70.1
GND  (via drill 0.3, 0.36, 0.36 pad 0.3, 0.36 pad 0.41, 0.38, 0.41, 0.46, 0.51)
  Top 0.254: v88.67,73.43 88.48,73.24 85.56,73.24 v85.37,73.43
  Top 0.305: CY.2 42.14,29.43 CLOCKGEN.8 | v49.71,73.99 v51.49,73.99 | MODE_ROS.C v90.6,37.36 | I2C_GPIO.9 v39.88,44.65 | I2C_GPIO.3 I2C_GPIO.4 I2C_GPIO.5
  Top 0.356: v46.94,24.43 46.94,25.45 | v44.65,28.37 44.65,27.38 | v16.51,81.36 18.52,81.36 v18.54,81.33 | MODE_MANUAL.C v86.59,37.36 | v8.64,25.4 8.64,26.07 R18.2
  Top 0.4: v18.97,79.48 16.99,79.48 16.92,79.4 | 14.05,77.72 14.07,77.75 v16.87,77.75 16.89,77.78 v19.05,77.78
  Top 0.406: v48.26,75.18 51.82,75.18 | POWER.C 22.53,1.62 v22.53,2.72 | v30.43,59.33 v30.43,60.86 v30.43,62.38 v30.43,63.91 v30.43,65.43 30.43,68.35 v30.56,68.48 v30.56,70.16 | v49.1,58.45 v49.1,60.91 v49.1,62.36 v49.1,63.73 v49.1,65.1 v49.1,68.15 | C1.2 83.15,66.79 v83.16,66.78 | 9.04,26.48 R18.2 | v19.13,16 C3.2 19.15,14.45 v19.15,12.93 | v19.13,16 | v21.74,16 21.77,15.98 C5.2 21.79,14.45 v21.79,12.93 | v30.56,79.25 v33.35,79.25 v35.87,79.25 | v30.56,77.32 v33.33,77.32 v35.87,77.32 | v16.89,79.4 14.07,79.4 v14.05,79.43 | v82.83,51.46 82.75,51.54 LED_DRIVER1.8 | MODE_SWITCH.1 85.15,29.58 v85.04,29.59 | I2C_GPIO.4 36.62,44.33 v36.63,44.65 | v41.71,31.17 41.71,30.39 CY.2 | v34.06,48.95 33.34,48.95 C4.2
  Top 0.5: v49.68,79.3 v52.12,79.3 | v29.52,74.09 33.53,74.09 33.53,74.17
  Top 0.508: PGM.P$4 45.84,40.73 | 45.84,40.73 v45.85,40.72 | PGM.P$3 45.84,40.73 | v35.89,67.44 35.89,68.52 C2.2 | v49.68,77.62 v52.15,77.62
  Top 0.61: v12.47,73.86 16.48,73.86
  Top 0.66: v43.56,54.13 42.6,54.13 LED_DRIVER2.8
  Bottom 0.305: MOT1.B12 9.6,86 MOT1.B11
  Bottom 0.381: 44.65,86 MOT3.B12 | MOT3.B11 42.65,84.56 43.18,85.09 | MOT4.B11 60.18,84.31 60.96,85.09 | MOT5.B11 77.7,84.05 78.74,85.09
  other vias: 33.45,74.12 14.05,77.75 16.46,73.86 51.79,75.18
  pour Bottom (rank 2): 0.1,99.11 99.16,99.16 99.52,0.15 81.99,0.15 81.99,25.1 74.02,25.1 71.02,22.1 71.02,13.26 65.74,7.98 63.65,7.98 63.65,0.15 48.06,0.15 48.06,3.1 50.65,3.1 50.65,5.33 47.7,5.33 47.7,12.9 34.65,12.9 34.65,0.1 -0.1,0
  pour Top (isolate 0.203, no thermals, hatched): 82.14,25.45 74.22,25.45 70.92,22.15 70.92,13.56 65.68,8.13 63.5,8.13 63.5,0.46 82.14,0.46
  pour Bottom (isolate 0.203, no thermals, hatched): 82.14,25.45 74.22,25.45 70.92,22.15 70.92,13.56 65.68,8.13 63.5,8.13 63.5,0.46 82.14,0.46
  pour Bottom (rank 2, no thermals, hatched): 34.49,13.16 34.44,0.1 48.21,0.15 48.21,3.05 50.8,3.05 50.8,5.38 47.96,5.38 47.75,13
  pour Top (isolate 0.203, no thermals, hatched): 50.85,10.46 48.36,10.46 45.52,13 36.83,13 34.49,10.67 34.49,2.64 37.03,0.1 45.97,0.1 48.97,3.1 50.75,3.1 50.75,5.33 48.16,5.33 48.16,8.18 50.85,8.18
GND1  (via drill 0.41)
  Top 0.406: v30.5,75.62 v33.3,75.62 v35.31,75.62
I2C_GP1
  Top 0.203: I2C_GPIO.13 39.22,51.16 39.78,51.71 TP10.TP
MISO  (via drill 0.3)
  Top 0.203: MOT2.A7 23.53,78.99 25.76,78.99 26.66,80 | 41.66,78.94 43.13,78.99 | MOT6.A7 89.8,79.95 v89.48,79.96 | MOT6.A5 93.59,76.96 95.61,76.96 96.57,76 97.38,76 98,75.37 98,74.62 97.56,74.17 97.56,68.61 97.57,68.59 97.57,63.89 93.4,59.72 v93.4,55.78 | v88.75,52.17 85.85,52.17 76.61,42.93 76.07,42.93 v76.05,42.9 | v89.97,52.17 v91.95,54.15 | v71.5,79.93 71.52,79.95 MOT5.A7
  Top 0.229: 6,78.99 8.23,78.99 | 26.66,80 MOT3.A7
  Top 0.25: TEENSY3.2.12 68.2,34.67 69.09,35.56
  Top 0.254: MOT1.A7 6,78.99 | 8.23,78.99 9.13,80 11.89,80.29 14.91,80.09 19.2,80.24 20.3,79.93 MOT2.A7 | MOT3.A7 41.66,78.94 | 43.13,78.99 44.08,80 MOT4.A7 59.19,78.99 60.86,78.99 61.94,80.07 62.56,80.07 62.6,80.11 v69.29,80.11 | MOT5.A7 76.51,78.99 78.28,78.99 79.25,79.96 v87.38,79.96 | 69.09,35.56 69.49,35.97 69.49,41.05 71.37,42.93 v72.34,42.93
  Top 0.406: MOT6.A5 MOT6.A7
  Bottom 0.203: v89.48,79.96 v87.38,79.96 | v69.29,80.11 71.32,80.11 v71.5,79.93 | v88.75,52.17 v89.97,52.17 | v93.4,55.78 91.97,54.15 v91.95,54.15 | v72.34,42.93 76.02,42.93 v76.05,42.9
MODE  (via drill 0.3 pad 0.41, 0.36)
  Top 0.254: v60.63,30.79 71.7,30.79 v72.11,31.19 | MODE_SWITCH.2 88.68,30.09 87.53,31.24 76.68,31.24 v76.63,31.19
  Bottom 0.254: v72.11,31.19 72.4,30.9 72.52,30.9 72.72,30.7 75.76,30.7 75.97,30.9 76.34,30.9 v76.63,31.19
  Bottom 0.305: TEENSY3.2.28 58.42,30.79 v60.63,30.79
MOSI  (via drill 0.3)
  Top 0.203: 4.62,76.96 8.23,77.01 | MOT2.A6 23.01,78.95 23.93,78.03 23.93,77.88 24.69,77.01 25.76,77.01 26.72,77.98 37.18,77.98 MOT3.A6 40.74,78.95 41.3,78.38 41.3,77.88 42.11,77.01 43.28,77.01 44.2,77.98 45.47,77.98 46.02,78.28 54.94,78.26 MOT4.A6 58.11,78.95 58.78,78.23 58.78,77.83 59.54,77.01 60.66,77.01 61.62,77.98 62.99,77.98 63.96,78.94 v69.32,78.94 | MOT5.A6 75.59,78.95 76.4,78.13 76.4,77.93 77.27,77.01 78.28,77.01 79.08,77.9 | 79.15,77.98 79.08,77.9 | v87.05,78.74 86.28,77.98 79.15,77.98 79.08,77.9 | v93.34,78.94 95.63,78.94 96.55,78.03 97.35,78.03 98.37,77 98.37,74.47 98.09,74.19 98.09,63.83 94.23,59.97 v94.23,54.89 | v88.75,51.33 85.6,51.33 77.72,43.46 77.72,42.27 76.61,41.15 v76.1,41.15 | v89.97,51.33 90.81,51.33 v92.81,53.34
  Top 0.25: TEENSY3.2.11 69.22,32.13 70.1,33.02 70.1,39.88 71.37,41.15
  Top 0.254: MOT1.A6 4.12,77.93 4.12,77.42 4.62,76.96 | 8.23,77.01 9.2,78.03 10.36,78.03 11.3,78.69 19.22,78.66 MOT2.A6 20.58,78.95 | 71.37,41.15 v72.34,41.15
  Bottom 0.203: MOT5.A6 v69.32,78.95 v69.32,78.94 | v93.34,78.94 v93.34,78.95 MOT6.A6 | v88.75,51.33 v89.97,51.33 | v92.81,53.34 94.23,54.76 v94.23,54.89 | v72.34,41.15 v76.1,41.15
  Bottom 0.254: MOT6.A6 87.25,78.95 v87.05,78.74
N$1
  Top 0.406: IA0515S.+VOUT 8.14,53.76 F2.1
N$2
  Top 0.406: IA0515S.-VOUT 10.67,49.15 10.67,57.42 F3.1
N$3  (via drill 0.3)
  Top 0.203: v41.96,62 41.6,61.65 36.5,61.65 36.2,61.34 LED_DRIVER2.14
  Top 0.254: 36.17,60.25 LED_DRIVER2.14 | M3.C 44.43,66.66 v41.96,64.19 v41.96,64.18
  Bottom 0.254: v41.96,62 v41.96,64.18
N$5
  Top 0.254: R21.1 91.64,56.62 94.12,54.14 95.77,54.14 96.55,53.36 ENABLE_GLOBAL.A
N$6
  Top 0.305: TSM150P04LCS.4 D1.A 6.98,26.12 R18.1
N$7  (via drill 0.3)
  Top 0.203: STATUS_M3.C 40.74,66.68 | v51.54,64.41 52.48,63.47 52.83,63.47 59.17,63.56 v59.56,63.96
  Top 0.254: 40.74,66.68 40.74,63.95 41.15,63.55 43.48,63.55 44.35,64.41 v46.33,64.41 | LED_DRIVER1.14 75.56,56.52 74.93,55.88 69.19,55.88 v65.81,59.26 | v59.56,62 62.61,62 v62.74,62.13
  Bottom 0.203: v59.56,63.96 v59.56,62
  Bottom 0.254: v46.33,64.41 v51.54,64.41 | v62.74,62.13 63.5,62.13 65.48,60.15 65.48,59.9 65.81,59.56 v65.81,59.26
N$8
  Top 1.27: F1.P$2 TSM150P04LCS.5 TSM150P04LCS.6 TSM150P04LCS.7 TSM150P04LCS.8
N$9
  Top 0.406: POWER.A 26.92,3.73 R17.1
N$11
  Top 0.203: LED_DRIVER1.10 80.64,58.67 80.97,59 82.47,59 86.36,55.12 91.91,55.12 ENABLE_GLOBAL.C
N$12  (via drill 0.3)
  Top 0.203: MODE_SWITCH.5 89.38,35.79 89.38,39.12 89.38,39.37 89.38,53.31 v90.58,54.51 | R20.1 89.59,57.2 v90.58,56.21
  Bottom 0.203: v90.58,56.21 v90.58,54.51
N$13
  Top 0.254: MODE_MANUAL.A 85.56,35.08 MODE_SWITCH.4
N$14
  Top 0.254: MODE_ROS.A 91.63,35.08 MODE_SWITCH.6
N$17
  Top 0.406: D3.P$1 49.58,1.78 TEENSY3.2.VIN 48.56,0.76 34.8,0.76 30.99,4.57 D2.P$1
N$18
  Top 1.27: PWN_MAIN.P2 2.36,10.01 F1.P$1
N$19
  Top 0.305: R2.1 73.93,66.95 STATUS_M5.A
N$20
  Top 0.381: R3.1 STATUS_M1.A
N$21
  Top 0.254: STATUS_M2.A 21.05,67.48 22.5,68.94 22.5,69.58 R4.1
N$22
  Top 0.254: R5.1 38.83,66.9 STATUS_M3.A
N$23
  Top 0.305: STATUS_M4.A 56.1,68.99 R6.1
N$24
  Top 0.305: R7.1 91.3,66.7 STATUS_M6.A
N$25
  Top 0.406: TEENSY3.2.VUSB 53.21,4.19 54.54,2.86 D3.P$2
N$55
  Top 0.305: R10.1 77.48,66.8 M5.A
N$56
  Top 0.254: R11.1 6.01,66.86 M1.A
N$57
  Top 0.254: R12.1 26.5,69.12 24.74,67.36 24.74,66.73 M2.A
N$58
  Top 0.254: R13.1 42.43,66.8 M3.A
N$59
  Top 0.305: M4.A 59.76,69.09 R14.1
N$60
  Top 0.305: R15.1 94.81,66.7 M6.A
N$63  (via drill 0.3)
  Top 0.203: v13.39,61.85 16.66,61.85 v16.89,61.62 | v19.94,61.59 v23.34,61.59 | v26.16,61.59 28.52,61.59 v28.55,61.62 | v46.43,61.59 44.35,61.59 43.22,62.73 33.74,62.73 v32.64,61.62
  Top 0.254: STATUS_M1.C 4.71,66.21 5.33,65.58 8.43,65.58 10.06,63.91 v10.06,61.72 | v51.51,61.59 51.66,61.74 55.2,61.74 56.12,62.66 62.33,62.66 65.3,65.63 v65.38,65.63 | v67.49,65.63 71.07,65.63 v72.06,64.64 | v72.06,61.98 73.03,61.01 LED_DRIVER1.16
  Bottom 0.203: v10.06,61.72 11.07,61.72 11.35,61.44 12.98,61.44 v13.39,61.85 | v16.89,61.62 19.91,61.62 v19.94,61.59 | v23.34,61.59 v26.16,61.59
  Bottom 0.254: v46.43,61.59 v51.51,61.59 | v65.38,65.63 v67.49,65.63 | v72.06,64.64 v72.06,61.98 | v28.55,61.62 v32.64,61.62
N$64  (via drill 0.3)
  Top 0.203: v32.66,63.2 32.77,63.09 43.43,63.09 43.56,63.09 46.35,63.09 v46.41,63.04
  Top 0.254: STATUS_M2.C 25.94,63.2 v28.5,63.2 | v51.51,63.04 61.92,63.2 65.41,66.67 v65.41,67.08 | LED_DRIVER1.15 74.27,57.71 74.27,60.73 v73.05,61.95 | v67.51,67.06 68.5,66.06 71.5,66.06 72.9,64.67 v72.92,64.67
  Bottom 0.254: v28.5,63.2 v32.66,63.2 | v46.41,63.04 v51.51,63.04 | v65.41,67.08 v67.51,67.06 | v72.92,64.67 72.92,64.54 72.49,64.11 72.49,62.51 v73.05,61.95
N$66  (via drill 0.3)
  Top 0.254: STATUS_M4.C 58.2,64.65 v58.19,64.64 | LED_DRIVER1.13 76.83,56.01 76.28,55.45 69.01,55.45 65.81,58.65 65.56,58.65 65.5,58.71 v65.11,58.71 | v61.9,61.32 58.73,61.32 v58.04,62
  Bottom 0.254: v58.19,64.64 58.19,62.15 v58.04,62 | v65.11,58.71 65.11,59.65 65.05,59.72 65.05,59.92 63.65,61.32 v61.9,61.32
N$67  (via drill 0.3)
  Top 0.254: STATUS_M5.C 75.78,65.5 v75.79,65.53 | v75.79,61.82 78.11,59.56 LED_DRIVER1.12
  Bottom 0.254: v75.79,65.53 v75.79,61.82
N$68  (via drill 0.3)
  Top 0.254: STATUS_M6.C 93.2,64.3 92.25,63.35 v83.97,63.42 | v83.52,61.77 81.61,61.77 79.35,59.51 79.35,57.71 LED_DRIVER1.11
  Bottom 0.254: v83.97,63.42 83.52,62.89 v83.52,61.77
N$69  (via drill 0.3)
  Top 0.203: v32.64,64.62 34.04,64.62 v34.92,63.73 | v34.92,62.1 LED_DRIVER2.15
  Top 0.254: M2.C 26.81,66.06 v28.5,64.62
  Bottom 0.203: v32.64,64.62 v28.5,64.62 | v34.92,63.73 v34.92,62.1
N$71  (via drill 0.3)
  Top 0.203: v51.59,59.94 52.77,61.13 v53.37,61.13 | v53.35,62.35 54.94,62.35 v55.08,62.48
  Top 0.254: v46.41,59.87 46.18,58.88 44.7,57.4 38.81,57.4 37.49,58.73 37.49,60.2 LED_DRIVER2.13 | M4.C 59.72,64.57 59.31,64.57 58.75,64.01 55.14,64.01 v55.06,64.09
  Bottom 0.203: v46.41,59.87 46.72,59.56 47.24,59.55 51.2,59.55 v51.59,59.94 | v53.37,61.13 53.37,62.34 v53.35,62.35
  Bottom 0.254: v55.06,64.09 55.08,64.07 v55.08,62.48
N$72  (via drill 0.3)
  Top 0.203: M5.C 79.48,65.54 77.98,64.03 66.75,64.03 60.93,58.22 v59.84,57.48 | v58.67,58.6 58.19,59.08 v51.77,59.08
  Top 0.254: v45.31,59.16 44.2,57.96 39.7,57.96 38.76,58.9 38.76,60.2 LED_DRIVER2.12
  Bottom 0.203: v58.67,58.6 59.79,57.48 v59.84,57.48
  Bottom 0.254: v45.31,59.16 51.71,59.13 v51.77,59.08
N$73  (via drill 0.3, 0.41)
  Top 0.254: M6.C 92.64,62.64 67.56,62.64 57.89,52.96 v57.89,52.93 | v43.84,58.85 40.34,58.83 40.03,59.13 40.03,60.2 LED_DRIVER2.11 | v46.51,56.19 47.95,54.74 49.15,54.74 v49.17,54.76 | v51.51,54.74 56.01,54.74 v56.03,54.76
  Bottom 0.254: v43.84,58.85 v46.51,56.19 | v51.51,54.74 51.48,54.76 v49.17,54.76 | v56.03,54.76 57.86,52.93 v57.89,52.93
N$74  (via drill 0.3, 0.3 pad 0.36, 0.38)
  Top 0.254: v34.75,58.14 33.66,59.23 LED_DRIVER2.16 | v28.73,60.07 27.81,60.07 v26.95,60.94 | v23.98,60.96 v20.6,60.96 | v17.48,60.96 v13.46,60.96 | M1.C 10.72,64.25 v10.72,60.96
  Bottom 0.254: v34.75,58.14 34.72,58.17 33.27,58.17 31.37,60.07 v28.73,60.07 | v20.6,60.96 v17.48,60.96 | v23.98,60.96 24,60.94 v26.95,60.94 | v13.46,60.96 v10.72,60.96
N$99
  Top 0.254: TEENSY3.2.13 49.45,42.41 R1.1
PGM  (via drill 0.3, 0.36)
  Top 0.254: PGM.P$2 48.79,37.74 v48.79,36.6 | v50.67,36.6 v52.53,36.6
  Top 0.508: PGM.P$1 PGM.P$2
  Bottom 0.254: v52.53,36.6 54.46,34.67 TEENSY3.2.PGM | v48.79,36.6 v50.67,36.6
SCL
  Top 0.203: CLOCKGEN.4 42.64,21.15 R8.1 | 49.55,19.43 TEENSY3.2.19/A5 49.45,20.55 50.84,21.94 50.84,32.17 49.87,33.13 48.96,33.13 48.41,32.59 48.41,31.74 48.06,31.38 47.76,31.38 46.67,32.47 46.67,32.93 45.97,33.63 45.9,33.7 42.93,36.58 40.51,36.58 34.67,42.42 I2C_GPIO.1
  Top 0.305: TEENSY3.2.19/A5 48.56,20.32 R8.1
SCLK  (via drill 0.3, 0.38 pad 0.41)
  Top 0.2: 72.04,72.82 72.57,72.82 73.15,72.83 75.01,72.83 75.36,72.83 | 89.14,72.83 89.4,72.83 89.54,72.97
  Top 0.203: MOT6.A2 90.6,74.03 89.54,72.97 | 89.14,72.83 78.9,72.83 v78.46,72.69 | v76.48,73.08 76.34,73.14 75.36,72.83 | MOT5.A2 74.3,73.85 74.3,73.58 75.01,72.87 75.01,72.83 | 72.04,72.82 72,72.78 63.91,72.78 63.66,73.04 61.38,73.04 v60.81,72.47 | 57.14,73.22 57.3,73.05 58.37,73.05 v58.55,73.23 | 57.14,73.22 56.78,73.58 55.68,74.67 MOT4.A2 | 57.14,73.22 56.58,72.66 55.72,72.66 54.97,73.41 46.53,73.41 v46.43,73.51 | v41.49,75.02 43.15,75.02 v44.6,73.56 | v23.29,74.93 25.47,74.93 26.51,73.89 v27.15,73.89 | v19.18,73.51 19.18,73.5 18.63,72.95 12.19,72.92 8.36,72.92 v8.23,72.8 | MOT1.A2 3.1,73.61 3.94,72.77 v6.71,72.77
  Top 0.254: v28.65,75.08 28.79,74.95 MOT3.A2 | R1.2 49.76,46.38 49.78,47.24 49.78,70.36 47.83,72.31 v46.46,72.31 | 46.63,73.51 v46.43,73.51
  Bottom 0.203: v78.46,72.69 77.24,72.69 v76.48,73.08 | v58.55,73.23 59.31,72.47 v60.81,72.47 | v44.6,73.56 44.65,73.51 v46.43,73.51 46.43,72.34 v46.46,72.31 | MOT3.A2 41.42,74.95 v41.49,75.02 | v23.29,74.93 20.64,74.93 | 20.64,74.93 MOT2.A2 | v28.65,75.08 27.46,73.89 v27.15,73.89 | v19.18,73.51 20.6,74.93 20.64,74.93 | v8.23,72.8 8.2,72.77 v6.71,72.77
SDA  (via drill 0.3)
  Top 0.203: TEENSY3.2.18/A4 49.45,23.09 50.46,24.09 50.46,30.01 49.65,30.81 v49.33,30.81 | I2C_GPIO.2 35.32,42.41 40.64,37.08 43.18,37.08 47.78,32.49 v47.78,32.21
  Top 0.254: CLOCKGEN.5 43.14,22.3 R9.1
  Top 0.305: TEENSY3.2.18/A4 49.02,22.4 R9.1
  Bottom 0.203: v47.78,32.21 49.17,30.81 v49.33,30.81
SDI01
  Top 0.381: MOT1.A4 3.1,78.99
SDI12  (via drill 0.3)
  Top 0.254: v11.02,77.32 12.08,76.86 MOT2.A4
  Bottom 0.254: MOT1.A5 6.04,76.96 8.23,77.01 9.04,76 10.21,76 11.02,76.81 v11.02,77.32
SDI23  (via drill 0.3 pad 0.41)
  Top 0.203: v28.32,76.63 28.38,76.69 37.9,76.69 MOT3.A4
  Bottom 0.203: MOT2.A5 23.56,77.01 25.65,77.01 26.67,76 27.69,76 v28.32,76.63
SDI34  (via drill 0.46 pad 0.41)
  Top 0.203: v46.43,76.91 46.91,76.66 54.95,76.66 MOT4.A4
  Bottom 0.203: MOT3.A5 41.23,77.95 42.22,77.01 43.23,77.01 44.15,76 45.31,76 v46.43,76.91
SDI45  (via drill 0.3)
  Top 0.203: v63.63,77.14 63.87,76.95 MOT5.A4
  Bottom 0.203: MOT4.A5 58.61,77.01 60.6,77.01 61.47,76.07 62.84,76.07 63.55,76.76 v63.63,77.14 63.55,77.37
SDI56  (via drill 0.36)
  Top 0.203: v81.41,76.76 81.84,76.43 90.36,76.43 MOT6.A4
  Bottom 0.203: MOT5.A5 76.09,77.01 78.28,77.01 79.15,77.98 80.26,77.98 v81.41,76.76
SS1
  Top 0.178: MOT1.A8 2.13,80.08 2.13,72.64 3.15,71.63
  Top 0.203: 27.64,52.32 8.33,71.63 3.15,71.63 | 40.49,23.34 40.49,19.76 42.75,17.53 48.82,17.53 TEENSY3.2.20/A6
  Top 0.254: 27.64,52.32 27.64,36.27 31.39,32.51 34.29,32.51 40.49,26.31 40.49,23.34
SS2  (via drill 0.3, 0.3 pad 0.41)
  Top 0.203: 16.92,63.75 16.92,64.95 16.47,65.39 15.61,65.39 14.35,66.65 14.35,67.06 14.35,67.16 14.35,67.23 14.46,67.34 14.46,71.44 v14.91,71.88 | MOT2.A8 20.37,80.7 v14.76,80.7
  Top 0.254: TEENSY3.2.17/A3 48.06,25.91 48.06,28.14 41.76,34.44 30.43,34.44 28.3,36.58 28.3,52.32 20.47,60.15 16.97,63.7 16.92,63.75
  Bottom 0.203: v14.91,71.88 14.48,72.31 14.48,74.51 14.63,74.67 14.63,75.01 14.94,75.31 14.94,80.52 v14.76,80.7
SS3  (via drill 0.3, 0.3 pad 0.3, 0.36 pad 0.3)
  Top 0.203: v31.47,80.59 32.08,80.59 32.26,80.42 37.62,80.42 MOT3.A8
  Top 0.254: TEENSY3.2.15/A1 49.43,29.57 48.16,29.57 42.27,35.46 32.56,35.46 31.6,36.42 31.5,36.52 30.67,37.35 v30.67,54.29 | v31.32,72.24 31.5,71.27 31.18,70.95 31.18,68.22 31.07,68.11 v31.07,56.22
  Bottom 0.203: v31.32,72.24 31.53,72.45 31.53,72.47 31.67,72.61 31.67,80.19 v31.47,80.59
  Bottom 0.254: v30.67,54.29 30.67,55.81 v31.07,56.22
SS4  (via drill 0.3, 0.3 pad 0.41)
  Top 0.254: MOT4.A8 50.98,80.95 v50.8,80.77 | v50.77,72.24 50.77,40.1 52.49,38.38 v54.13,38.38
  Bottom 0.203: TEENSY3.2.29 55.6,33.2 55.6,37.92 55.14,38.38 v54.13,38.38
  Bottom 0.254: v50.8,80.77 v50.77,72.24
SS5  (via drill 0.3)
  Top 0.203: v53.72,28.04 53.53,28.64 53.53,35.93 55.14,37.54 55.14,52.43 59.26,56.55 59.26,57.72 59.6,58.06 60.02,58.06 60.69,58.51 66.86,64.69 66.86,68.07 66.87,70.3 v67.31,71.22 | v67.28,73.38 68.53,74.62 v70.05,74.62 | v71.7,77.62 70.87,78.46 70.87,80.24 71.58,80.95 MOT5.A8 | v53.21,25.68 54.38,24.51 TEENSY3.2.32
  Bottom 0.203: v67.31,71.22 67.07,71.46 67.07,71.48 66.9,71.65 66.9,72.69 67.28,73.08 v67.28,73.38 | v70.05,74.62 71.7,76.28 v71.7,77.62 | v53.72,28.04 53.52,27.84 53.52,25.98 v53.21,25.68
SS6  (via drill 0.3)
  Top 0.203: v56.13,30.86 56.03,31.06 56.03,51.97 67.21,63.14 82.25,63.14 86.86,67.75 v86.86,71.86 | v86.86,73.84 86.86,74.84 v87.07,75.06 | v87.33,77.04 87.53,76.83 88.77,76.83 89.1,77.17 89.13,78.29 88.9,78.49 88.88,80.22 89.45,80.72 89.69,80.72 89.92,80.95 | 89.85,80.95 89.92,80.95 | 89.92,80.95 MOT6.A8
  Bottom 0.203: TEENSY3.2.30 54.97,29.59 v56.13,30.86 | v86.86,71.86 v86.86,73.84 | v87.07,75.06 87.33,75.31 v87.33,77.04
STATUS_M1  (via drill 0.3)
  Top 0.254: LED_DRIVER1.1 73.03,29.87 71.22,28.07 64.27,28.07 61.98,25.77 61.98,23.88 60.78,22.68 v60.6,22.68 | v58.67,22.71 57.94,21.97 TEENSY3.2.24
  Bottom 0.254: v60.6,22.68 58.7,22.68 v58.67,22.71
STATUS_M2
  Top 0.254: LED_DRIVER1.2 74.3,46.86 73.44,46.01 73.44,30.99 73.44,30.72 73.44,28.11 68.45,23.11 65.84,23.11 TEENSY3.2.7
STATUS_M3
  Top 0.254: TEENSY3.2.6 67.84,22.58 68.51,22.58 73.91,27.98 73.91,45.21 75.56,46.86 LED_DRIVER1.3
STATUS_M4
  Top 0.254: LED_DRIVER1.4 76.83,47.12 74.42,44.7 74.42,27.9 68.86,22.34 68.86,21.06 TEENSY3.2.5
STATUS_M5
  Top 0.254: TEENSY3.2.3 69.34,16.46 69.34,22.23 74.93,27.81 74.93,44.2 78.11,47.37 LED_DRIVER1.5
STATUS_M6
  Top 0.254: TEENSY3.2.2 70.1,14.68 70.1,22.35 75.44,27.69 75.44,43.69 79.38,47.62 LED_DRIVER1.6
SYNC  (via drill 0.3)
  Top 0.203: MOT6.A3 92.6,75.51 89.56,72.46 85.88,72.46 85.25,71.83 v78.11,71.83 | MOT5.A3 75.2,75.22 76.11,74.32 77.06,73.36 77.06,72.57 v76.68,72.19 75.64,72.19 75.41,72.42 62.28,72.42 | v58.8,71.58 59.11,71.88 61.03,71.88 61.56,72.42 62.28,72.42 | 63.73,70.97 62.28,72.42 | MOT4.A3 57.68,75.22 58.58,74.32 59.8,73.1 59.81,73.1 59.81,72.82 59.61,72.62 57.91,72.62 v57.76,72.47 57.71,72.42 57.07,72.42 56.69,72.29 55.34,72.29 54.68,72.95 46.68,72.95 46.67,72.94 45.88,72.94 45.43,72.48 41.36,72.48 41.12,72.24 | v41.25,73.48 41.05,73.81 41.05,74.32 40.15,75.22 MOT3.A3 | v41.25,72.24 41.12,72.24 | 41.12,72.24 35.66,72.24 35.09,72.81 30.24,72.81 29.71,72.3 27.32,72.28 26.78,71.7 v23.88,71.73 21.44,71.73 20.68,72.49 8.74,72.49 8.24,72 8.18,72 7.37,72.81 7.37,72.96 6.7,73.62 6.7,74.35 MOT1.A3 | MOT2.A3 22.63,75.46 21.59,74.42 21.59,73.66 22.25,73 v23.88,73
  Top 0.254: TEENSY3.2.27 58.37,30.89 58.37,52.02 59.94,53.59 59.94,54.41 65.69,60.15 v66.09,60.15 | v63.4,62.81 65.61,65.02 65.63,65.02 66.06,65.46 66.06,66.06 66.07,66.06 66.07,67.31 66.04,67.34 66.04,70.61 65.68,70.97 63.73,70.97
  Bottom 0.203: v76.68,72.19 77.04,71.83 v78.11,71.83 | v58.8,71.58 57.91,72.47 v57.76,72.47 | v41.25,73.48 v41.25,72.24
  Bottom 0.254: v66.09,60.15 63.42,62.81 v63.4,62.81 | v23.88,73 v23.88,71.73
TOUCH_DOWN
  Top 0.305: DOWN.BUTTON 74.93,4.19 TEENSY3.2.0
TOUCH_MENU
  Top 0.305: TEENSY3.2.23/A9 43.38,9.27 MENU.BUTTON
TOUCH_UP
  Top 0.305: UP.BUTTON 76.35,17.58 66.4,7.62 65.58,7.62 TEENSY3.2.1
VIN
  Top 0.406: TSM150P04LCS.2 9.53,23.88 D1.C
  Top 0.508: TSM150P04LCS.3 TSM150P04LCS.2 TSM150P04LCS.1 10.79,19.61 C3.1 15.93,8.71 DCDC-5V.P$1
  pour Top: 99.11,88.44 0,88.49 0.03,99.01 99.19,99.06
  pour Top: 3.81,64.77 1.52,64.77 1.52,89.15 0.51,89.15 0.51,72.64 0.25,64.77 0.56,17.86 11.28,17.83 11.28,22.81 7.87,22.86 7.87,19.56 4.06,19.56
XA
  Top 0.203: CLOCKGEN.2 41.64,25.94 42.22,26.52 46.18,26.52 Y1.HOT2
XB
  Top 0.203: Y1.HOT1 44.48,25.7 42.47,25.7 42.14,25.38 CLOCKGEN.3

## Text on the board
tPlace: M0 | M1 | M2 | M3 | M4 | M5 | MANUAL<-->ROS | PGM | MANUAL CONTROL | Select Motor: / MENU + UP/DOWN / / Jog Motor: / UP/DOWN | + | - | 12-36V
200bmp: MOTOR CONTROL BOARD | REV 1.1 | TREVOR BRUNS | MED LAB